# EAGLE design tl062-testing (EAGLE 5.07)
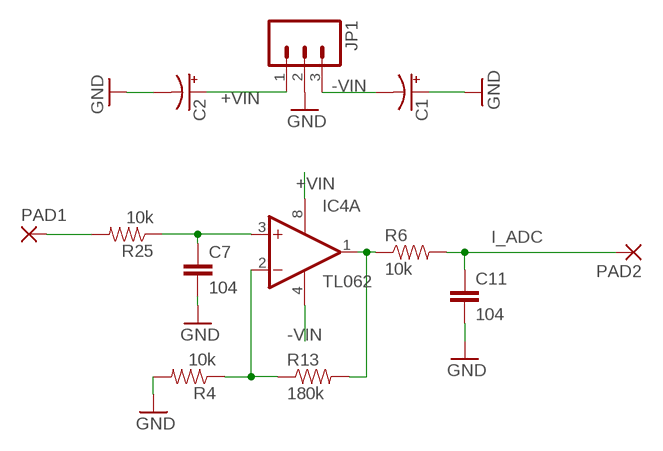
[diagram p0: schematic, sheet 1]

## Parts
C1  CAP_POL-RF  [CPOL-SMD-10UF-25V]
C2  CAP_POL-RF  [CPOL-SMD-10UF-25V]
C7  104  CAP-RF  [CAP-SMD-SMALL]
C11  104  CAP-RF  [CAP-SMD-SMALL]
IC4  TL062  [DIP08-L]
JP1  M03LOCK_LONGPADS  [1X03_LOCK_LONGPADS]
PAD1  SMD5  [SMD2,54-5,08]
PAD2  SMD5  [SMD2,54-5,08]
R4  10k  RESISTOR1/4W-RF  [AXIAL-0.3-SMD]
R6  10k  RESISTOR1/4W-RF  [AXIAL-0.3-SMD]
R13  180k  RESISTOR1/4W-RF  [AXIAL-0.3-SMD]
R25  10k  RESISTOR1/4W-RF  [AXIAL-0.3-SMD]

## Nets
+VIN: C2.+ IC4.8(P:V+) JP1.1
-VIN: C1.- IC4.4(P:V-) JP1.3
GND: C1.+ C2.- C7.P$2 C11.P$2 JP1.2 R4.P$2
I_ADC: C11.P$1 PAD2.1(P) R6.P$2
N$1: PAD1.1(P) R25.P$2
N$31: IC4.2(A:-IN) R4.P$1 R13.P$1
N$32: IC4.1(A:OUT) R6.P$1 R13.P$2
N$54: C7.P$1 IC4.3(A:+IN) R25.P$1
Unconnected: IC4.5(B:+IN) IC4.6(B:-IN) IC4.7(B:OUT)

## Library data of the parts
C1 C2 = digital-toy:CAP_POL: Capacitor Polarized These are standard SMD and PTH capacitors. Normally 10uF, 47uF, and 100uF in electrolytic and tantalum varieties. Always verify the external diameter of the through hole cap, it varies with capacity, voltage, and manufacturer. The EIA devices should be standard. PANASONIC_D size: 6.5mmx6.5mmx5.5mm, 100uf (taobao:6.3mmx5.5mm), same as CVL0605 153cvl0405 size: 4mmx4mmx5.5mm, 10uf (taobao:4mmx5.5mm) ct6032 typical 47uF Tantalum, comment by hyl.
C7 C11 = digital-toy:CAP: Capacitor Standard 0603 ceramic capacitor, and 0.1" leaded capacitor.
IC4 = digital-toy:TL062: Linear Devices dual Operational amplifiers, JFET-Input Stage Input offset voltage:typical 3mV(25C)
JP1 = SparkFun:M03: Header 3 Standard 3-pin 0.1" header. Use with straight break away headers (SKU : PRT-00116), right angle break away headers (PRT-00553), swiss pins (PRT-00743), machine pins (PRT-00117), and female headers (PRT-00115). Molex polarized connector foot print use with SKU : PRT-08232 with associated crimp pins and housings.
PAD1 PAD2 = wirepad:SMD5: SMD PAD
R4 R6 R13 R25 = digital-toy:RESISTOR: Resistor Basic schematic elements and footprints for 0603, 1206, and PTH 1/10th watt (small) resistors. digital-toy copy vertical mount of axial-0.3 from rcl.lbr : the 0207/xx

## Board
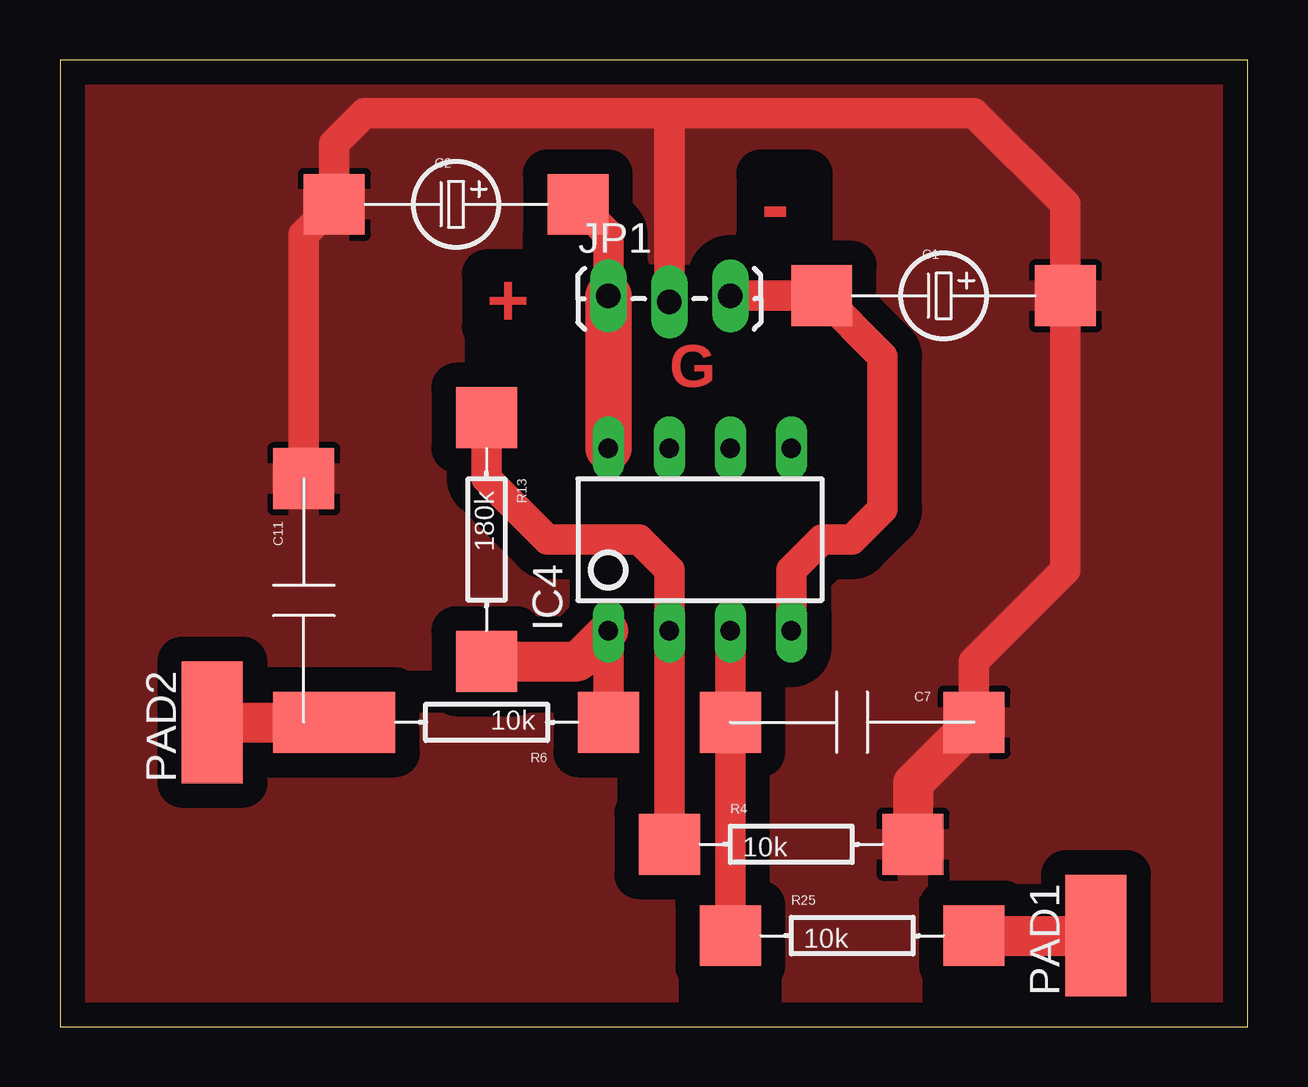
[diagram p1: board, top side]

Size 49.51 x 40.31 mm. Coordinates in mm from the lower left corner, seen from the top.
Outline: 0,0 49.51,0 49.51,40.31 0,40.31 0,0
Copper layers (1*16): Top 0.035mm / dielectric 1.5mm / Bottom 0.035mm
Design rules "default": minimum track width 10mil, minimum drill 24mil, track to track 8mil, track to pad 8mil, pad to pad 8mil, via to via 8mil, smd to smd 8mil, copper to edge 40mil, drill to drill 8mil, minimum pad ring 10mil, minimum via ring 8mil, stop-mask expansion 4mil, vias tented up to drill 0mil, thermal gap 10mil

### Footprints (pad centres in the part's own frame; a part is rotated, then mirrored left to right if it is on the bottom)
CPOL-SMD-10UF-25V = smd 2.54 x 2.54: + 5.08,0; - -5.08,0
CAP-SMD-SMALL = smd 2.54 x 2.54: P$1 5.08,0; P$2 -5.08,0
DIP08-L = drill 0.813 long: 1 0,-2.54; 2 2.54,-2.54; 3 5.08,-2.54; 4 7.62,-2.54; 5 7.62,5.08; 6 5.08,5.08; 7 2.54,5.08; 8 0,5.08
1X03_LOCK_LONGPADS = drill 1.016 long: 1 0,0; 2 2.54,-0.254; 3 5.08,0
SMD2,54-5,08 = smd 2.54 x 5.08: 1 0,0
AXIAL-0.3-SMD = smd 2.54 x 2.54: P$1 -5.08,0; P$2 5.08,0

### Placement (x,y rotation side)
C1  36.83,30.48 0 top
C2  16.51,34.29 0 top
C7  33.02,12.7 180 top
C11  10.16,17.78 270 top
IC4  22.86,19.05 0 top
JP1  22.86,30.48 0 top
PAD1  43.18,3.81 0 top
PAD2  6.35,12.7 0 top
R4  30.48,7.62 0 top
R6  17.78,12.7 180 top
R13  17.78,20.32 270 top
R25  33.02,3.81 0 top

### Tracks (layer width: path | path; a pad name or v marks a point on that pad's centre or on a via)
+VIN
  Top 1.27: JP1.1 22.86,33.02 C2.+
  Top 1.93: IC4.8 JP1.1
-VIN
  Top 1.27: IC4.4 30.48,19.05 31.75,20.32 33.02,20.32 34.29,21.59 34.29,27.94 C1.- JP1.3
GND
  Top 1.27: C11.P$2 10.16,33.02 C2.- 11.43,36.83 12.7,38.1 25.4,38.1 | 25.4,38.1 JP1.2 | 25.4,38.1 38.1,38.1 41.91,34.29 C1.+ 41.91,19.05 38.1,15.24 C7.P$2
  Top 1.676: R4.P$2 35.56,10.16 C7.P$2
  pour Top (isolate 1.016): -13.97,46.99 55.88,46.99 67.31,35.56 67.31,7.62 53.34,-6.35 -10.16,-6.35 -11.43,-5.08 -11.43,44.45
I_ADC
  Top 1.676: PAD2.1 C11.P$1 R6.P$2
N$1
  Top 1.676: R25.P$2 PAD1.1
N$31
  Top 1.27: R4.P$1 IC4.2 25.4,19.05 24.13,20.32 20.32,20.32 17.78,22.86 R13.P$1
N$32
  Top 1.27: IC4.1 R6.P$1
  Top 1.676: R13.P$2 21.59,15.24 IC4.1
N$54
  Top 1.27: R25.P$1 C7.P$1 IC4.3

### Text on the board
Top: - | + | G